# Altium project Galileo_Control_Board.PrjPCB
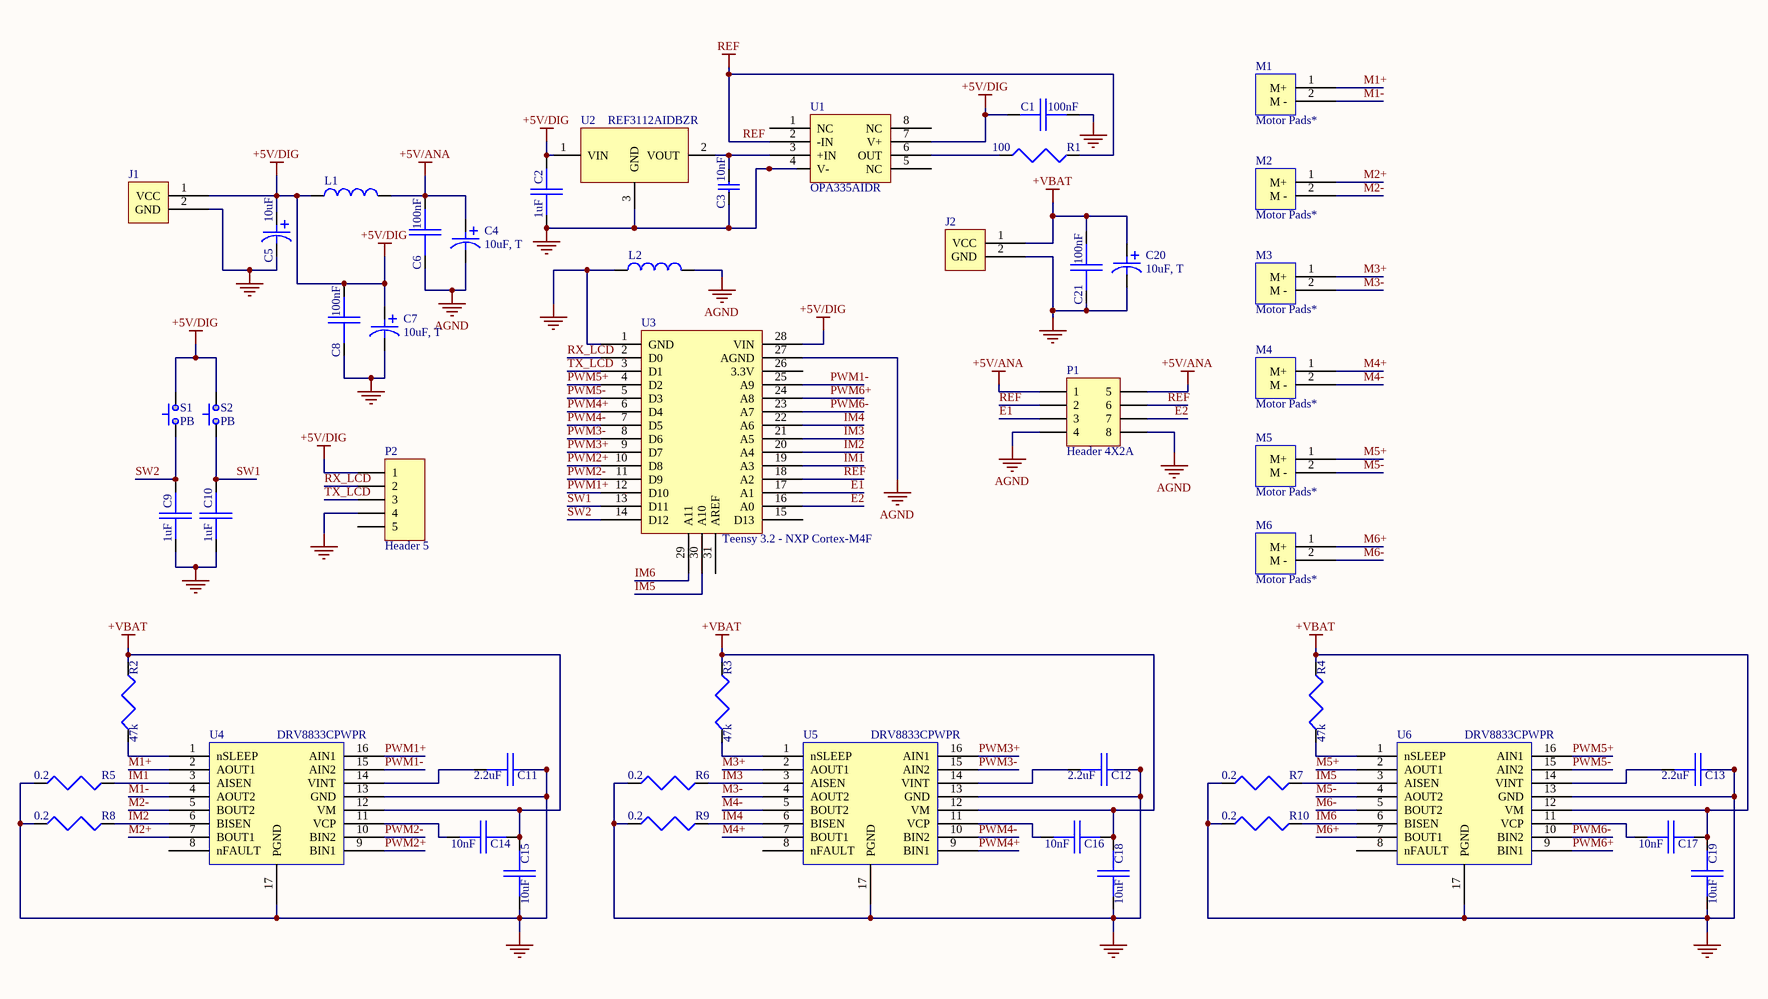
[diagram p0: Galileo_Control_Board.SchDoc]
1 sheet, 51 parts. Net scope: global (net labels, ports and power ports of the same name join across sheets).
Board file: Galileo_Control_Board.PcbDoc

## Sheet Galileo_Control_Board.SchDoc
size A3

### Parts
C1  100nF  [C0603]
C2  1uF  [C0603]
C3  10nF  [C0805]
C4  10uF, T  [C1206]
C5  10uF  [CSVB]
C6  100nF  [C0603]
C7  10uF, T  [C1206]
C8  100nF  [C0603]
C9  1uF  [C0603]
C10  1uF  [C0603]
C11  2.2uF  [C0603]
C12  2.2uF  [C0603]
C13  2.2uF  [C0603]
C14  10nF  [C0603]
C15  10uF  [C0603]
C16  10nF  [C0603]
C17  10nF  [C0603]
C18  10uF  [C0603]
C19  10uF  [C0603]
C20  10uF, T  [C1206]
C21  100nF  [C0603]
J1  TERMINAL BLOCK  2POS 3.5MM  [2POS3.5mm]  (value not drawn)
J2  TERMINAL BLOCK  2POS 3.5MM  [2POS3.5mm]  (value not drawn)
L1  EMI FILTER BED  [R0603]  (value not drawn)
L2  EMI FILTER BED  [R0603]  (value not drawn)
M1  Motor Pads*  [Motor_PAD]
M2  Motor Pads*  [Motor_PAD]
M3  Motor Pads*  [Motor_PAD]
M4  Motor Pads*  [Motor_PAD]
M5  Motor Pads*  [Motor_PAD]
M6  Motor Pads*  [Motor_PAD]
P1  Header 4X2A  [HDR2X4_CEN]
P2  Header 5  [HDR1X5]
R1  100  [R0603]
R2  47k  [R0603]
R3  47k  [R0603]
R4  47k  [R0603]
R5  0.2  [R1206]
R6  0.2  [R1206]
R7  0.2  [R1206]
R8  0.2  [R1206]
R9  0.2  [R1206]
R10  0.2  [R1206]
S1  PB  [SW]
S2  PB  [SW]
U1  OPA335AIDR  [SO-8]
U2  REF3112AIDBZR  [SOT-23]
U3  Teensy 3.2 - NXP Cortex-M4F  [DIP28]
U4  DRV8833CPWPR  [SOP16]
U5  DRV8833CPWPR  [SOP16]
U6  DRV8833CPWPR  [SOP16]

### Nets
+5V/ANA: C4.1 C6.2 L1.2 P1.1 P1.5
+5V/DIG: C1.2 C2.2 C5.1 C7.1 C8.2 J1.1(VCC) L1.1 P2.1 S1.2 S2.2 U1.7(V+) U2.1(VIN) U3.28(VIN)
+VBAT: C14.2 C15.2 C16.2 C17.2 C18.2 C19.2 C20.1 C21.2 J2.1(VCC) R2.2 R3.2 R4.2 U4.12(VM) U5.12(VM) U6.12(VM)
AGND: C4.2 C6.1 L2.2 P1.4 P1.8 U3.27(AGND)
GND: C1.1 C2.1 C3.1 C5.2 C7.2 C8.1 C9.1 C10.1 C11.2 C12.2 C13.2 C15.1 C18.1 C19.1 C20.2 C21.1 J1.2(GND) J2.2(GND) L2.1 P2.4 R5.1 R6.1 R7.1 R8.1 R9.1 R10.1 U1.4(V-) U2.3(GND) U3.1(GND) U4.13(GND) U4.17(PGND) U5.13(GND) U5.17(PGND) U6.13(GND) U6.17(PGND)
REF: P1.2 P1.6 R1.1 U1.2(-IN) U3.18(A2)
E1: P1.3 U3.17(A1)
E2: P1.7 U3.16(A0)
IM1: R5.2 U3.19(A3) U4.3(AISEN)
IM2: R8.2 U3.20(A4) U4.6(BISEN)
IM3: R6.2 U3.21(A5) U5.3(AISEN)
IM4: R9.2 U3.22(A6) U5.6(BISEN)
IM5: R7.2 U3.30(A10) U6.3(AISEN)
IM6: R10.2 U3.29(A11) U6.6(BISEN)
M1+: M1.1(M+) U4.2(AOUT1)
M1-: M1.2(M_-) U4.4(AOUT2)
M2+: M2.1(M+) U4.7(BOUT1)
M2-: M2.2(M_-) U4.5(BOUT2)
M3+: M3.1(M+) U5.2(AOUT1)
M3-: M3.2(M_-) U5.4(AOUT2)
M4+: M4.1(M+) U5.7(BOUT1)
M4-: M4.2(M_-) U5.5(BOUT2)
M5+: M5.1(M+) U6.2(AOUT1)
M5-: M5.2(M_-) U6.4(AOUT2)
M6+: M6.1(M+) U6.7(BOUT1)
M6-: M6.2(M_-) U6.5(BOUT2)
PWM1+: U3.12(D10) U4.16(AIN1)
PWM1-: U3.25(A9) U4.15(AIN2)
PWM2+: U3.10(D8) U4.9(BIN1)
PWM2-: U3.11(D9) U4.10(BIN2)
PWM3+: U3.9(D7) U5.16(AIN1)
PWM3-: U3.8(D6) U5.15(AIN2)
PWM4+: U3.6(D4) U5.9(BIN1)
PWM4-: U3.7(D5) U5.10(BIN2)
PWM5+: U3.4(D2) U6.16(AIN1)
PWM5-: U3.5(D3) U6.15(AIN2)
PWM6+: U3.24(A8) U6.9(BIN1)
PWM6-: U3.23(A7) U6.10(BIN2)
RX_LCD: P2.2 U3.2(D0)
SW1: C10.2 S2.1 U3.13(D11)
SW2: C9.2 S1.1 U3.14(D12)
TX_LCD: P2.3 U3.3(D1)
NetC3_2: C3.2 U1.3(+IN) U2.2(VOUT)
NetC11_1: C11.1 U4.14(VINT)
NetC12_1: C12.1 U5.14(VINT)
NetC13_1: C13.1 U6.14(VINT)
NetC14_1: C14.1 U4.11(VCP)
NetC16_1: C16.1 U5.11(VCP)
NetC17_1: C17.1 U6.11(VCP)
NetR1_2: R1.2 U1.6(OUT)
NetR2_1: R2.1 U4.1(nSLEEP)
NetR3_1: R3.1 U5.1(nSLEEP)
NetR4_1: R4.1 U6.1(nSLEEP)

Not connected (* = marked no-connect by the designer): P2 5; U1 1(NC) 5(NC) 8(NC); U3 15(D13) 26(3.3V) 31(AREF); U4 8(nFAULT); U5 8(nFAULT); U6 8(nFAULT)

### Library data of the parts
C1 C6 C8 C21 = GRM188R71E104KA01D: CAP CER 0.1UF 25V X7R 0603; Manufacturer: Murata Electronics North America; Capacitance: 0.1µF; Tolerance: ±10%; Supplier 1: Digi-Key; Manufacturer Part Number: GRM188R71E104KA01D; RoHS: RoHS Compliant; Category: Capacitors; Stock 1: 5973420; Pricing 1: 1=0.1, 10=0.019, 50=0.0104, 100=0.0088, 250=0.0072, 500=0.00616, 1000=0.0048 (USD); Packaging: Cut Tape (CT); Voltage - Rated: 25V; Temperature Coefficient: X7R; Mounting Type: Surface Mount, MLCC; Operating Temperature: -55°C ~ 125°C; Applications: General Purpose; Ratings: -; Package / Case: 0603 (1608 Metric); Size / Dimension: 0.063" L x 0.031" W (1.60mm x 0.80mm); Height - Seated (Max): -; Thickness (Max): 0.035" (0.90mm); Lead Spacing: -; Features: -; Lead Style: -; ComponentLink1URL: http://www.murata.com/~/media/webrenewal/support/library/catalog/products/capacitor/mlcc/c02e.pdf; ComponentLink1Description: http://www.murata.com/~/media/webrenewal/support/library/catalog/products/capacitor/mlcc/c02e.pdf; Supplier Part Number 1: 490-1524-1-ND
C2 C9 C10 = GRM188R61E105KA12D: CAP CER 1UF 25V X5R 0603; Manufacturer: Murata Electronics North America; Capacitance: 1µF; Tolerance: ±10%; Supplier 1: Digi-Key; Manufacturer Part Number: GRM188R61E105KA12D; RoHS: RoHS Compliant; Category: Capacitors; Stock 1: 1934941; Pricing 1: 1=0.1, 10=0.044, 50=0.0238, 100=0.0202, 250=0.01652, 500=0.01412, 1000=0.01101 (USD); Packaging: Cut Tape (CT); Voltage - Rated: 25V; Temperature Coefficient: X5R; Mounting Type: Surface Mount, MLCC; Operating Temperature: -55°C ~ 85°C; Applications: General Purpose; Ratings: -; Package / Case: 0603 (1608 Metric); Size / Dimension: 0.063" L x 0.031" W (1.60mm x 0.80mm); Height - Seated (Max): -; Thickness (Max): 0.035" (0.90mm); Lead Spacing: -; Features: -; Lead Style: -; ComponentLink1URL: http://www.murata.com/~/media/webrenewal/support/library/catalog/products/capacitor/mlcc/c02e.pdf; ComponentLink1Description: http://www.murata.com/~/media/webrenewal/support/library/catalog/products/capacitor/mlcc/c02e.pdf; Supplier Part Number 1: 490-3897-1-ND
C3 = GRM216R71H103KA01D: CAP CER 10000PF 50V X7R 0805; Manufacturer: Murata Electronics North America; Tolerance: ±10%; Supplier 1: Digi-Key; Manufacturer Part Number: GRM216R71H103KA01D; RoHS: RoHS Compliant; Category: Capacitors; Stock 1: 1473285; Pricing 1: 1=0.1, 10=0.031, 50=0.0168, 100=0.0142, 250=0.01164, 500=0.00998, 1000=0.00777 (USD); Packaging: Cut Tape (CT); Capacitance: 10000pF; Voltage - Rated: 50V; Temperature Coefficient: X7R; Mounting Type: Surface Mount, MLCC; Operating Temperature: -55°C ~ 125°C; Applications: General Purpose; Ratings: -; Package / Case: 0805 (2012 Metric); Size / Dimension: 0.079" L x 0.049" W (2.00mm x 1.25mm); Height - Seated (Max): -; Thickness (Max): 0.028" (0.70mm); Lead Spacing: -; Features: -; Lead Style: -; ComponentLink1URL: http://www.murata.com/~/media/webrenewal/support/library/catalog/products/capacitor/mlcc/c02e.pdf; ComponentLink1Description: http://www.murata.com/~/media/webrenewal/support/library/catalog/products/capacitor/mlcc/c02e.pdf; Supplier Part Number 1: 490-1664-1-ND
C4 C7 C20 = T491C106K020AT: CAP TANT 10UF 20V 10% 2413; Manufacturer: Kemet; Manufacturer Size Code: C; Capacitance: 10µF; ESR (Equivalent Series Resistance): 1.8 Ohm; TYPE: IC; Lifetime @ Temp.: 2000 Hrs @ 85°C; Manufacturer Part Number: T491C106K020AT; RoHS: RoHS Compliant; Category: Capacitors; Packaging: Cut Tape (CT); Tolerance: ±10%; Voltage - Rated: 20V; Operating Temperature: -55°C ~ 125°C; Mounting Type: Surface Mount; Package / Case: 2413 (6032 Metric); Size / Dimension: 0.236" L x 0.126" W (6.00mm x 3.20mm); Height - Seated (Max): 0.110" (2.80mm); Lead Spacing: -; Features: General Purpose; ComponentLink1URL: http://www.kemet.com/Lists/ProductCatalog/Attachments/254/KEM_T2005_T491.pdf; ComponentLink1Description: http://www.kemet.com/Lists/ProductCatalog/Attachments/254/KEM_T2005_T491.pdf; Supplier 1: Digi-Key; Stock 1: 94667; Pricing 1: 1=0.73, 10=0.7, 50=0.418, 100=0.3396, 250=0.28216, 500=0.25602, 1000=0.23513 (USD); Supplier Part Number 1: 399-5152-6-ND
C5 = EEE-1EA100WR: CAP ALUM 10UF 20% 25V SMD; Manufacturer: Panasonic Electronic Components; Capacitance: 10µF; Lifetime @ Temp.: 1000 Hrs @ 85°C; TYPE: IC; Ripple Current: 22mA; Surface Mount Land Size: 0.169" L x 0.169" W (4.30mm x 4.30mm); Supplier 1: Digi-Key; Manufacturer Part Number: EEE-1EA100WR; RoHS: RoHS Compliant; Category: Capacitors; Stock 1: 144383; Pricing 1: 1=0.41, 10=0.319, 25=0.2612, 50=0.2102, 100=0.1668, 250=0.12324, 500=0.0957, 1000=0.0754 (USD); Packaging: Cut Tape (CT); Tolerance: ±20%; Voltage Rating: 25V; ESR (Equivalent Series Resistance): -; Operating Temperature: -40°C ~ 85°C; Applications: Automotive; Impedance: -; Lead Spacing: -; Size / Dimension: 0.157" Dia (4.00mm); Height - Seated (Max): 0.213" (5.40mm); Mounting Type: Surface Mount; Package / Case: Radial, Can - SMD; ComponentLink1URL: http://media.digikey.com/pdf/Data%20Sheets/Panasonic%20Capacitors%20PDFs/EEE_S_A.pdf; ComponentLink1Description: http://media.digikey.com/pdf/Data%20Sheets/Panasonic%20Capacitors%20PDFs/EEE_S_A.pdf; Supplier Part Number 1: PCE3895CT-ND
C11-C13 = 06036D225KAT2A: CAP CER 2.2UF 6.3V X5R 0603; Manufacturer: AVX Corporation; Capacitance: 2.2µF; Tolerance: ±10%; Supplier 1: Digi-Key; Manufacturer Part Number: 06036D225KAT2A; RoHS: RoHS Compliant; Category: Capacitors; Stock 1: 9901; Pricing 1: 1=0.27, 10=0.224, 100=0.112, 250=0.084, 500=0.0742, 1000=0.0658 (USD); Packaging: Cut Tape (CT); Voltage - Rated: 6.3V; Temperature Coefficient: X5R; Mounting Type: Surface Mount, MLCC; Operating Temperature: -55°C ~ 85°C; Applications: General Purpose; Ratings: -; Package / Case: 0603 (1608 Metric); Size / Dimension: 0.063" L x 0.032" W (1.60mm x 0.81mm); Height - Seated (Max): -; Thickness (Max): 0.035" (0.90mm); Lead Spacing: -; Features: -; Lead Style: -; ComponentLink1URL: http://datasheets.avx.com/cx5r.pdf; ComponentLink1Description: http://datasheets.avx.com/cx5r.pdf; Supplier Part Number 1: 478-1252-1-ND
C14 C16 C17 = C0603C103K4RACTU: CAP CER 10000PF 16V X7R 0603; Manufacturer: Kemet; Tolerance: ±10%; Supplier 1: Digi-Key; Manufacturer Part Number: C0603C103K4RACTU; RoHS: RoHS Compliant; Category: Capacitors; Stock 1: 179935; Pricing 1: 1=0.25, 10=0.173, 50=0.105, 100=0.0882, 250=0.0714, 500=0.063, 1000=0.05355 (USD); Packaging: Cut Tape (CT); Capacitance: 10000pF; Voltage - Rated: 16V; Temperature Coefficient: X7R; Mounting Type: Surface Mount, MLCC; Operating Temperature: -55°C ~ 125°C; Applications: General Purpose; Ratings: -; Package / Case: 0603 (1608 Metric); Size / Dimension: 0.063" L x 0.031" W (1.60mm x 0.80mm); Height - Seated (Max): -; Thickness (Max): 0.034" (0.87mm); Lead Spacing: -; Features: -; Lead Style: -; ComponentLink1URL: http://www.kemet.com/docfinder?Partnumber=C0603C103K4RACTU; ComponentLink1Description: http://www.kemet.com/docfinder?Partnumber=C0603C103K4RACTU; Supplier Part Number 1: 399-7841-1-ND
C15 C18 C19 = GRT188R61E106ME13D: CAP CER 10UF 25V X5R 0603; Manufacturer: Murata Electronics North America; Capacitance: 10µF; Tolerance: ±20%; Supplier 1: Digi-Key; Manufacturer Part Number: GRT188R61E106ME13D; RoHS: RoHS Compliant; Category: Capacitors; Stock 1: 62; Pricing 1: 1=0.48, 10=0.424, 50=0.2576, 100=0.2121, 250=0.16968, 500=0.15454, 1000=0.13938 (USD); Packaging: Cut Tape (CT); Voltage - Rated: 25V; Temperature Coefficient: X5R; Mounting Type: Surface Mount, MLCC; Operating Temperature: -55°C ~ 85°C; Applications: Automotive; Ratings: AEC-Q200; Package / Case: 0603 (1608 Metric); Size / Dimension: 0.063" L x 0.031" W (1.60mm x 0.80mm); Height - Seated (Max): -; Thickness (Max): 0.035" (0.90mm); Lead Spacing: -; Features: -; Lead Style: -; ComponentLink1URL: http://search.murata.co.jp/Ceramy/image/img/A01X/G101/ENG/GRT188R61E106ME13-01.pdf; ComponentLink1Description: http://search.murata.co.jp/Ceramy/image/img/A01X/G101/ENG/GRT188R61E106ME13-01.pdf; Supplier Part Number 1: 490-12323-1-ND
J1 J2 = 0393570002: CONN TERMINAL BLOCK 2POS 3.5MM; Manufacturer: Molex, LLC; Number of Levels: 1; Positions Per Level: 2; Pitch: 0.138" (3.50mm); Mating Orientation: Horizontal with Board; Current: 12A; Voltage: 300V; Wire Gauge: 16-28 AWG; Wire Termination: Screw - Rising Cage Clamp; Clamp Material - Plating: Copper Alloy - Nickel Plated; Torque - Screw: 0.31 Nm (2.7 Lb-In); Screw Thread: M3; Supplier 1: Digi-Key; Manufacturer Part Number: 0393570002; RoHS: RoHS Compliant; Category: Connectors, Interconnects; Stock 1: 1266; Pricing 1: 1=1.1, 10=0.686, 50=0.528, 100=0.517, 250=0.44, 500=0.418, 1000=0.374, 2500=0.297, 5000=0.2926 (USD); Packaging: Bulk; Mounting Type: Through Hole; Features: -; Color: Black; Operating Temperature: -40°C ~ 105°C; Housing Material: Polyamide (PA), Nylon; Contact Material - Plating: Copper Alloy - Tin Plated; Screw Material - Plating: Copper Alloy - Nickel Plated; ComponentLink1URL: http://www.molex.com/pdm_docs/sd/393570002_sd.pdf; ComponentLink1Description: http://www.molex.com/pdm_docs/sd/393570002_sd.pdf; Supplier Part Number 1: WM7877-ND
L1 L2 = BLM18PG471SN1D: FERRITE BEAD 470 OHM 0603; Manufacturer: Murata Electronics North America; Filter Type: Power Line; Number of Lines: 1; Impedance @ Frequency: 470 Ohm @ 100MHz; Current Rating (Max): 1A; DC Resistance (DCR) (Max): 200 mOhm; Supplier 1: Digi-Key; Manufacturer Part Number: BLM18PG471SN1D; RoHS: RoHS Compliant; Category: Filters; Stock 1: 101023; Pricing 1: 1=0.1, 10=0.083, 50=0.0684, 100=0.0501, 250=0.03644, 500=0.0334, 1000=0.02884 (USD); Packaging: Cut Tape (CT); Ratings: -; Operating Temperature: -55°C ~ 125°C; Package / Case: 0603 (1608 Metric); Mounting Type: Surface Mount; Height (Max): 0.037" (0.95mm); Size / Dimension: 0.063" L x 0.031" W (1.60mm x 0.80mm); ComponentLink1URL: http://search.murata.co.jp/Ceramy/image/img/PDF/ENG/L0110S0100BLM18P.pdf; ComponentLink1Description: http://search.murata.co.jp/Ceramy/image/img/PDF/ENG/L0110S0100BLM18P.pdf; Supplier Part Number 1: 490-5223-1-ND
M1-M6 = Motor_PADs: Manufacturer: Portescap; Manufacturer Part Number: 22N1R78313P1001; Function: Standard; Motor Type: Brushed; Voltage - Rated: 9VDC; RPM: 10000 RPM; Torque - Rated (oz-in / mNm): 2.05 / 14.5; Power - Rated: 12W; Mounting Hole Spacing: 0.670" (17.00mm); Supplier 1: Digi-Key; RoHS: RoHS Compliant; Category: Motors, Solenoids, Driver Boards/Modules; Stock 1: 8; Pricing 1: 1=88.51, 5=86.956, 10=85.402, 25=83.8496, 50=82.6074, 100=80.744, 250=79.19128, 500=77.6385 (USD); TYPE: IC; Encoder Type: -; Size / Dimension: Round - 0.866" Dia (22.00mm); Diameter - Shaft: 0.059" (1.50mm); Length - Shaft and Bearing: 0.295" (7.50mm); Termination Style: Solder Tab; Features: -; Gear Reduction Ratio: -; Torque - Max Momentary (oz-in / mNm): -; Operating Temperature: -30°C ~ 85°C; Approvals: -; Weight: 0.117 lb (53.07g); Supplier Part Number 1: 403-1050-ND
P1 = Header 4X2A: Header, 4-Pin, Dual row; LatestRevisionDate: 17-Jul-2002; LatestRevisionNote: Re-released for DXP Platform.; Publisher: Altium Limited
P2 = Header 5: Header, 5-Pin; LatestRevisionDate: 17-Jul-2002; LatestRevisionNote: Re-released for DXP Platform.; Publisher: Altium Limited
R1 = ERJ-3EKF1000V: RES SMD 100 OHM 1% 1/10W 0603; Manufacturer: Panasonic Electronic Components; Power (Watts): 0.1W, 1/10W; Temperature Coefficient: ±100ppm/°C; Supplier 1: Digi-Key; Manufacturer Part Number: ERJ-3EKF1000V; RoHS: RoHS Compliant; Category: Resistors; Stock 1: 2225240; Pricing 1: 1=0.1, 50=0.0114, 100=0.0084, 250=0.00644, 500=0.00514, 1000=0.00379 (USD); Packaging: Cut Tape (CT); Resistance (Ohms): 100; Tolerance: ±1%; Composition: Thick Film; Features: Automotive AEC-Q200; Operating Temperature: -55°C ~ 155°C; Package / Case: 0603 (1608 Metric); Supplier Device Package: 0603; Size / Dimension: 0.063" L x 0.031" W (1.60mm x 0.80mm); Height: 0.022" (0.55mm); Number of Terminations: 2; ComponentLink1URL: http://industrial.panasonic.com/www-cgi/jvcr13pz.cgi?E+PZ+3+AOA0002+ERJ3EKF1000V+7+WW; ComponentLink1Description: http://industrial.panasonic.com/www-cgi/jvcr13pz.cgi?E+PZ+3+AOA0002+ERJ3EKF1000V+7+WW; Supplier Part Number 1: P100HCT-ND
R2-R4 = ERJ-3EKF4702V: RES SMD 47K OHM 1% 1/10W 0603; Manufacturer: Panasonic Electronic Components; Power (Watts): 0.1W, 1/10W; Temperature Coefficient: ±100ppm/°C; Supplier 1: Digi-Key; Manufacturer Part Number: ERJ-3EKF4702V; RoHS: RoHS Compliant; Category: Resistors; Stock 1: 3738786; Pricing 1: 1=0.1, 50=0.0114, 100=0.0084, 250=0.00644, 500=0.00514, 1000=0.00379 (USD); Packaging: Cut Tape (CT); Resistance (Ohms): 47k; Tolerance: ±1%; Composition: Thick Film; Features: Automotive AEC-Q200; Operating Temperature: -55°C ~ 155°C; Package / Case: 0603 (1608 Metric); Supplier Device Package: 0603; Size / Dimension: 0.063" L x 0.031" W (1.60mm x 0.80mm); Height: 0.022" (0.55mm); Number of Terminations: 2; ComponentLink1URL: http://industrial.panasonic.com/www-cgi/jvcr13pz.cgi?E+PZ+3+AOA0002+ERJ3EKF4702V+7+WW; ComponentLink1Description: http://industrial.panasonic.com/www-cgi/jvcr13pz.cgi?E+PZ+3+AOA0002+ERJ3EKF4702V+7+WW; Supplier Part Number 1: P47.0KHCT-ND
R5-R10 = ERJ-8BSJR20V: RES SMD 0.2 OHM 5% 1/2W 1206; Manufacturer: Panasonic Electronic Components; Power (Watts): 0.5W, 1/2W; Temperature Coefficient: ±250ppm/°C; Supplier 1: Digi-Key; Manufacturer Part Number: ERJ-8BSJR20V; RoHS: RoHS Compliant; Category: Resistors; Stock 1: 4865; Pricing 1: 1=0.43, 50=0.1858, 100=0.1381, 250=0.11668, 500=0.10002, 1000=0.07621 (USD); Packaging: Cut Tape (CT); Resistance (Ohms): 0.2; Tolerance: ±5%; Composition: Thick Film; Features: Automotive AEC-Q200, Current Sense; Operating Temperature: -55°C ~ 125°C; Package / Case: 1206 (3216 Metric); Supplier Device Package: 1206; Size / Dimension: 0.126" L x 0.063" W (3.20mm x 1.60mm); Height: 0.028" (0.70mm); Number of Terminations: 2; ComponentLink1URL: https://industrial.panasonic.com/cdbs/www-data/pdf/RDA0000/AOA0000C239.pdf; ComponentLink1Description: https://industrial.panasonic.com/cdbs/www-data/pdf/RDA0000/AOA0000C239.pdf; Supplier Part Number 1: P17692CT-ND
S1 S2 = D6C90 F1 LFS: SWITCH PUSH SPST-NO 0.1A 32V; Manufacturer: C&K Components; Switch Function: Off-Mom; Current Rating: 100mA (DC); Actuator Type: Square, Button; Color - Actuator/Cap: Black; Electrical Life: 250,000 Cycles; Supplier 1: Digi-Key; Manufacturer Part Number: D6C90 F1 LFS; RoHS: RoHS Compliant; Category: Switches; Stock 1: 9241; Pricing 1: 1=0.82, 10=0.767, 25=0.73, 50=0.6936, 100=0.6753, 250=0.657, 500=0.6205, 1000=0.584, 2500=0.52925 (USD); Packaging: Bulk; TYPE: IC; Circuit: SPST-NO; Voltage Rating - AC: -; Voltage Rating - DC: 32V; Illumination Type, Color: -; Illumination Voltage (Nominal): -; Mounting Type: Through Hole; Termination Style: PC Pin; Ingress Protection: -; Features: Tactile Feedback; Panel Cutout Dimensions: -; Operating Temperature: -20°C ~ 85°C; Mechanical Life: -; ComponentLink1URL: http://www.ck-components.com/index.php?module=media&action=Display&cmpref=13327&lang=en&width=&height=&format=&alt=; ComponentLink1Description: http://www.ck-components.com/index.php?module=media&action=Display&cmpref=13327&lang=en&width=&height=&format=&alt=; Supplier Part Number 1: 401-1969-ND
U1 = OPA335AIDR: IC OPAMP CHOPPER 2MHZ RRO 8SOIC; Manufacturer: Texas Instruments; Amplifier Type: Zero-Drift; Number of Circuits: 1; Output Type: Rail-to-Rail; Slew Rate: 1.6 V/µs; Current - Input Bias: 70pA; Voltage - Input Offset: 1µV; Current - Supply: 285µA; Current - Output / Channel: 50mA; Voltage - Supply, Single/Dual (±): 2.7 V ~ 5.5 V, ±1.35 V ~ 2.75 V; Supplier 1: Digi-Key; Manufacturer Part Number: OPA335AIDR; RoHS: RoHS Compliant; Category: Integrated Circuits (ICs); Stock 1: 1160; Pricing 1: 1=2.89, 10=2.594, 100=2.0805, 500=1.71, 1000=1.4155 (USD); Packaging: Cut Tape (CT); Gain Bandwidth Product: 2MHz; -3db Bandwidth: -; Operating Temperature: -40°C ~ 125°C; Mounting Type: Surface Mount; Package / Case: 8-SOIC (0.154", 3.90mm Width); Supplier Device Package: 8-SOIC; ComponentLink1URL: http://www.ti.com/lit/ds/symlink/opa334.pdf; ComponentLink1Description: http://www.ti.com/lit/ds/symlink/opa334.pdf; Supplier Part Number 1: 296-39124-1-ND
U2 = REF3112AIDBZR: IC VREF SERIES 1.25V SOT23-3; Manufacturer: Texas Instruments; Output Type: Fixed; Current - Output: 10mA; Tolerance: ±0.2%; Temperature Coefficient: 20ppm/°C; Noise - 0.1Hz to 10Hz: 17µVp-p; Noise - 10Hz to 10kHz: 24µVrms; Voltage - Input: 1.8 V ~ 5.5 V; Current - Supply: 135µA; Supplier 1: Digi-Key; Manufacturer Part Number: REF3112AIDBZR; RoHS: RoHS Compliant; Category: Integrated Circuits (ICs); Stock 1: 1754; Pricing 1: 1=2.71, 10=2.432, 100=1.9513, 500=1.6038, 1000=1.11375 (USD); Packaging: Cut Tape (CT); Reference Type: Series; Voltage - Output (Min/Fixed): 1.25V; Voltage - Output (Max): -; Current - Cathode: -; Operating Temperature: -40°C ~ 125°C (TA); Mounting Type: Surface Mount; Package / Case: TO-236-3, SC-59, SOT-23-3; Supplier Device Package: SOT-23-3; ComponentLink1URL: http://www.ti.com/lit/ds/symlink/ref3112.pdf; ComponentLink1Description: http://www.ti.com/lit/ds/symlink/ref3112.pdf; Supplier Part Number 1: 296-39158-1-ND
U3 = Teensy: Manufacturer: SparkFun Electronics; Manufacturer Part Number: DEV-13305; Board Type: Evaluation Platform; Core Processor: ARM® Cortex®-M0+; Platform: Teensy-LC; For Use With/Related Products: KL2x; Contents: Board(s); Supplier 1: Digi-Key; RoHS: RoHS Compliant; Category: Programmers, Development Systems; Stock 1: 0; Pricing 1: 1=14.38 (USD); TYPE: IC; Operating System: -; Mounting Type: Fixed; ComponentLink1URL: http://media.digikey.com/pdf/Data%20Sheets/Sparkfun%20PDFs/DEV-13305_Web.pdf; ComponentLink1Description: http://media.digikey.com/pdf/Data%20Sheets/Sparkfun%20PDFs/DEV-13305_Web.pdf; Supplier Part Number 1: 1568-1233-ND; Supplier 2: Digi-Key; Stock 2: 961; Pricing 2: 1=22.5 (USD); ComponentLink2URL: http://media.digikey.com/pdf/Data%20Sheets/Sparkfun%20PDFs/DEV-13736_Web.pdf; ComponentLink2Description: http://media.digikey.com/pdf/Data%20Sheets/Sparkfun%20PDFs/DEV-13736_Web.pdf; Supplier Part Number 2: 1568-1231-ND
U4-U6 = DRV8833CPWPR: IC MOTOR DRIVER PAR; Manufacturer: Texas Instruments; Output Configuration: Half Bridge (4); Interface: PWM; Load Type: Inductive; Rds On (Typ): 550 mOhm LS, 1.18 Ohm HS; Current - Output / Channel: 700mA; Current - Peak Output: 1A; Voltage - Supply: 2.7 V ~ 10.8 V; Fault Protection: Current Limiting, Over Temperature, Short Circuit, UVLO; Supplier 1: Digi-Key; Manufacturer Part Number: DRV8833CPWPR; RoHS: RoHS Compliant; Category: Integrated Circuits (ICs); Stock 1: 779; Pricing 1: 1=2.05, 10=1.843, 100=1.4783, 500=1.215, 1000=0.84375 (USD); Packaging: Cut Tape (CT); Applications: DC Motors, General Purpose, Solenoids, Stepper Motors; Technology: Power MOSFET; Voltage - Load: 2.7 V ~ 10.8 V; Operating Temperature: -40°C ~ 150°C (TJ); Features: Status Flag; Mounting Type: Surface Mount; Package / Case: 16-TSSOP (0.173", 4.40mm Width) Exposed Pad; Supplier Device Package: 16-HTSSOP; ComponentLink1URL: http://www.ti.com/lit/ds/symlink/drv8833c.pdf; ComponentLink1Description: http://www.ti.com/lit/ds/symlink/drv8833c.pdf; Supplier Part Number 1: 296-40078-1-ND